# Altium schematic sheet MCU.SchDoc
size A3; Organization: Altium Limited; Address1: L3, 12a Rodborough Rd; Address2: Frenchs Forest; Address3: NSW; Address4: Australia 2086
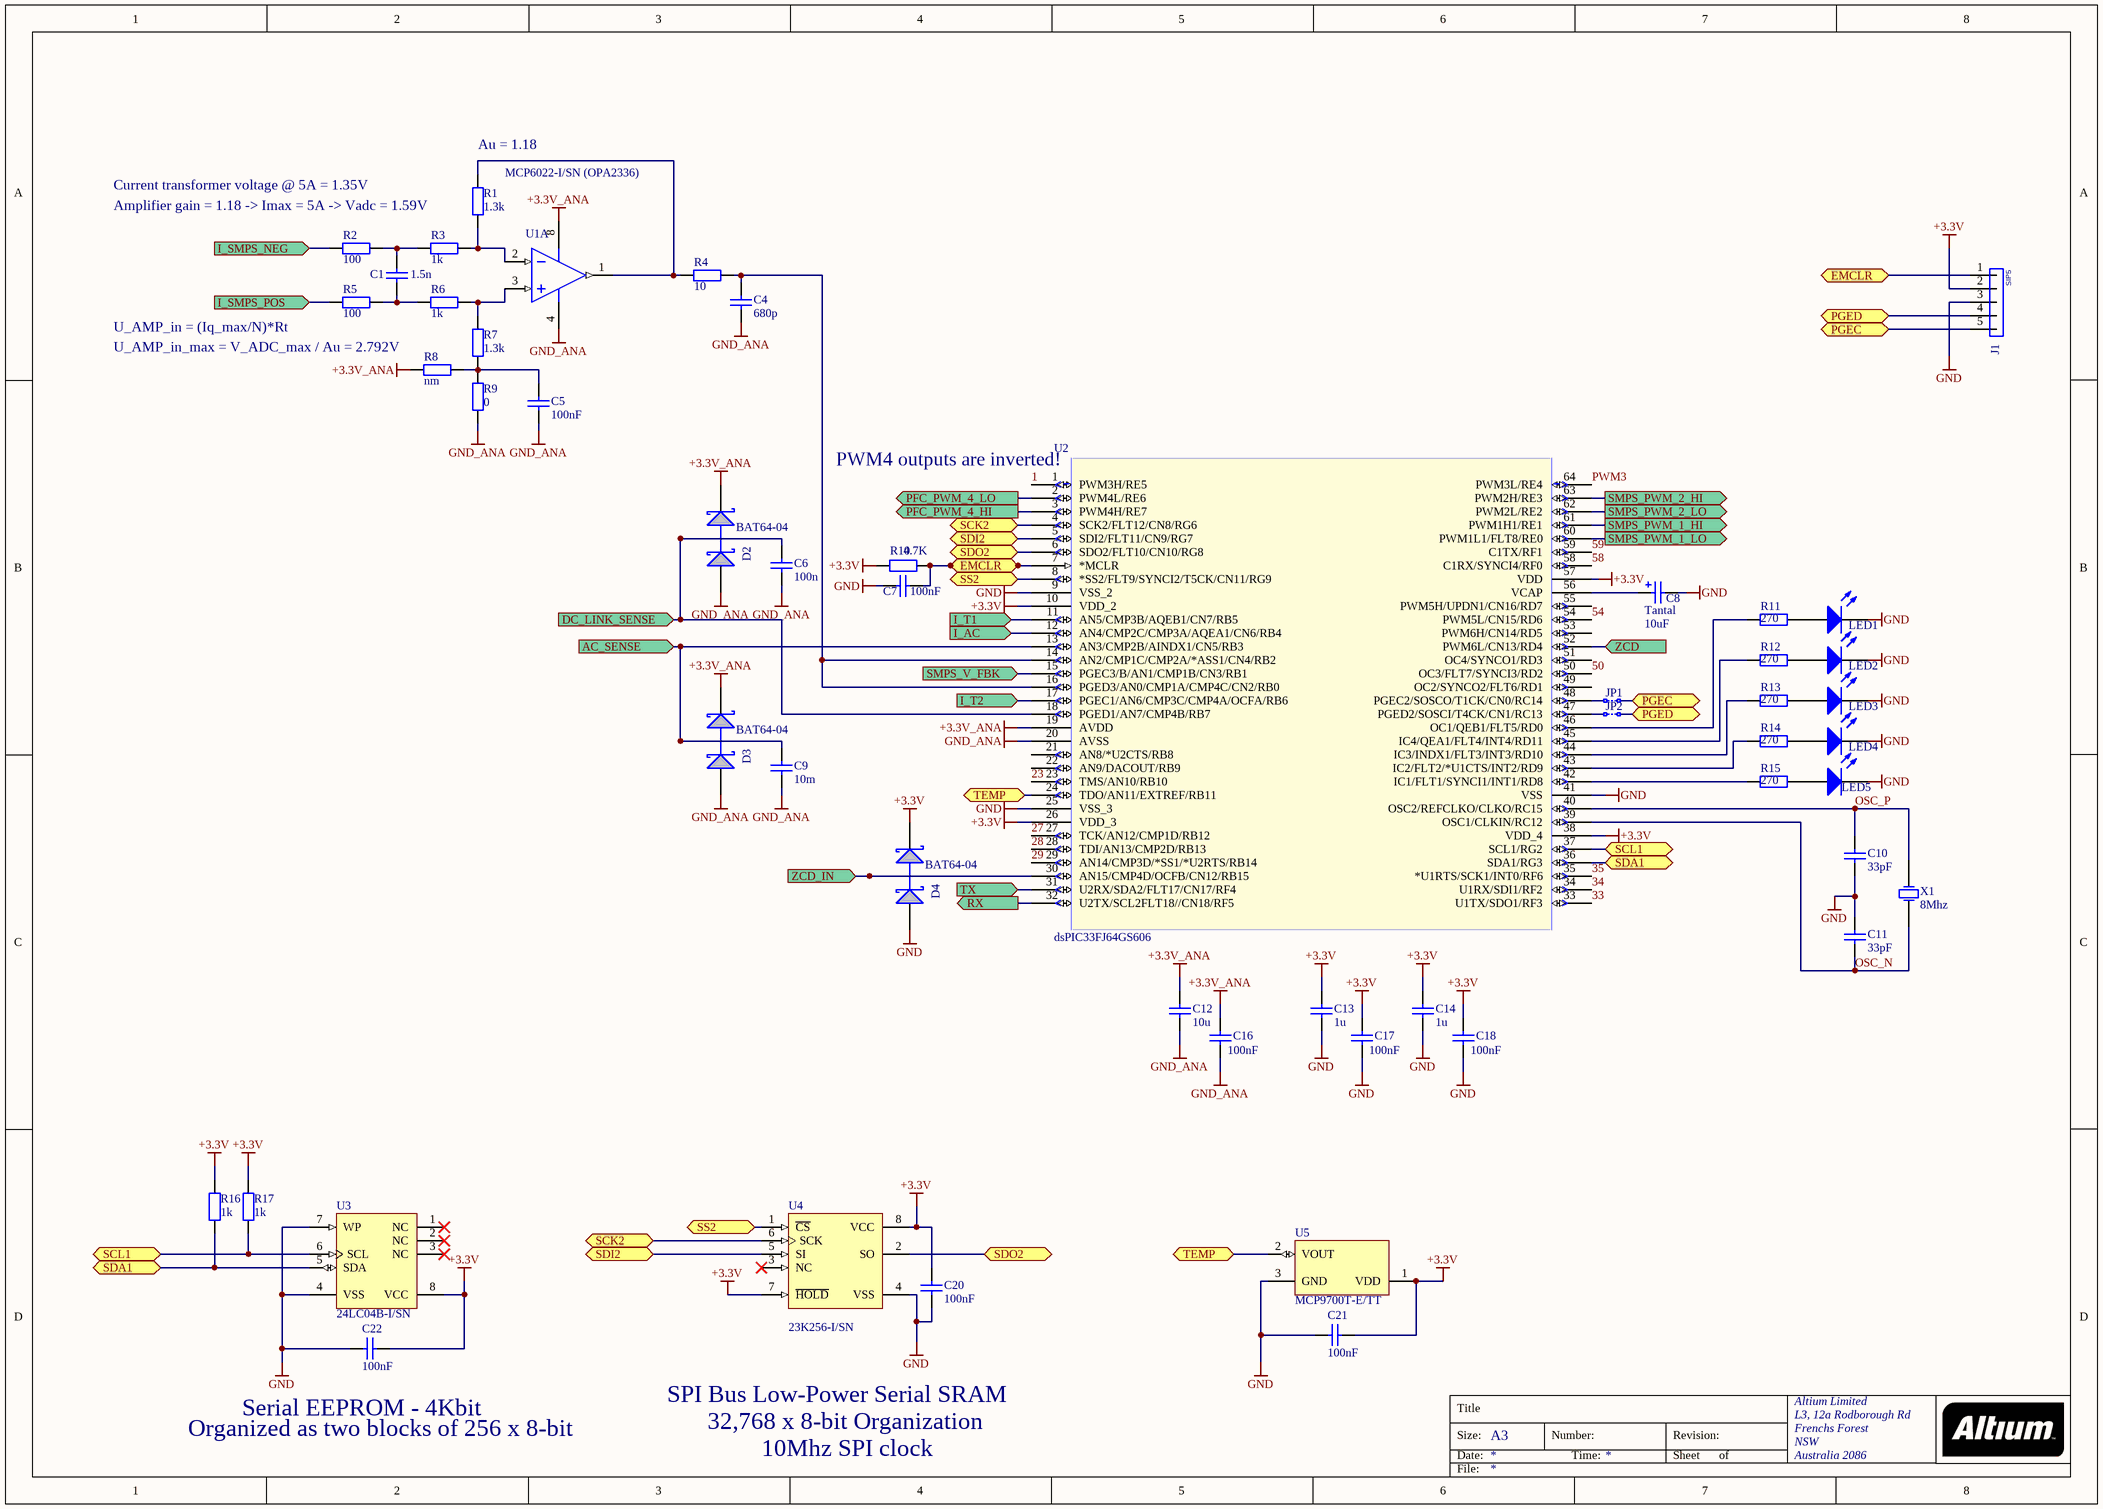
[diagram p0: MCU.SchDoc]

## Parts
C1  value 1.5n  [1206_REFLOW]  (hidden comment: Cap)
C4  value 680p  [1206_REFLOW]  (hidden comment: Cap)
C5  value 100nF  [1206_REFLOW]  (hidden comment: Cap)
C6  value 100n  [1206_REFLOW]  (hidden comment: Cap 1206)
C7  value 100nF  [1206_REFLOW]  (hidden comment: Cap 1206)
C8  Tantal  value 10uF  [CASE D]
C9  value 10m  [1206_REFLOW]  (hidden comment: Cap 1206)
C10  value 33pF  [1206_REFLOW]  (hidden comment: Cap)
C11  value 33pF  [1206_REFLOW]  (hidden comment: Cap)
C12  value 10u  [1206_REFLOW]  (hidden comment: Cap 1206)
C13  value 1u  [1206_REFLOW]  (hidden comment: Cap 1206)
C14  value 1u  [1206_REFLOW]  (hidden comment: Cap 1206)
C16  value 100nF  [1206_REFLOW]  (hidden comment: Cap 1206)
C17  value 100nF  [1206_REFLOW]  (hidden comment: Cap 1206)
C18  value 100nF  [1206_REFLOW]  (hidden comment: Cap 1206)
C20  value 100nF  [1206_REFLOW]  (hidden comment: Cap 1206)
C21  value 100nF  [1206_REFLOW]  (hidden comment: Cap 1206)
C22  value 100nF  [1206_REFLOW]  (hidden comment: Cap 1206)
D2  BAT64-04  [SOT23_HIS_Primary]
D3  BAT64-04  [SOT23_HIS_Primary]
D4  BAT64-04  [SOT23_HIS_Primary]
J1  SIP5  [SIP5 _2]
JP1  SOLDERCONTACT  [SOLDERCONTACT]  (value not drawn)
JP2  SOLDERCONTACT  [SOLDERCONTACT]  (value not drawn)
LED1  LED  [LED_1206]  (value not drawn)
LED2  LED  [LED_1206]  (value not drawn)
LED3  LED  [LED_1206]  (value not drawn)
LED4  LED  [LED_1206]  (value not drawn)
LED5  LED  [LED_1206]  (value not drawn)
R1  value 1.3k  [1206_REFLOW]  (hidden comment: RES)
R2  value 100  [1206_REFLOW]  (hidden comment: RES)
R3  value 1k  [1206_REFLOW]  (hidden comment: RES)
R4  value 10  [1206_REFLOW]  (hidden comment: RES)
R5  value 100  [1206_REFLOW]  (hidden comment: RES)
R6  value 1k  [1206_REFLOW]  (hidden comment: RES)
R7  value 1.3k  [1206_REFLOW]  (hidden comment: RES)
R8  value nm  [1206_REFLOW]  (hidden comment: RES)
R9  value 0  [1206_REFLOW]  (hidden comment: RES)
R10  value 4.7K  [1206_REFLOW]  (hidden comment: RES)
R11  value 270  [1206_REFLOW]  (hidden comment: RES)
R12  value 270  [1206_REFLOW]  (hidden comment: RES)
R13  value 270  [1206_REFLOW]  (hidden comment: RES)
R14  value 270  [1206_REFLOW]  (hidden comment: RES)
R15  value 270  [1206_REFLOW]  (hidden comment: RES)
R16  value 1k  [1206_REFLOW]  (hidden comment: RES)
R17  value 1k  [1206_REFLOW]  (hidden comment: RES)
U1  MCP6022-I/SN (OPA2336)  [SOIC-SN8_N]  (part A of 2)
U2  dsPIC33FJ64GS606  [TQFP-PT64_N]
U3  24LC04B-I/SN  [SOIC-SN8_N]
U4  23K256-I/SN  [SOIC-SN8_N]
U5  MCP9700T-E/TT  [SOT-23-TT3_N]
X1  value 8Mhz  [XTAL]  (hidden comment: XTAL)

## Ports
AC_SENSE (in), DC_LINK_SENSE (in), EMCLR, I_AC (in), I_SMPS_NEG (in), I_SMPS_POS (in), I_T1 (in), I_T2 (in), PFC_PWM_4_HI (out), PFC_PWM_4_LO (out), PGEC, PGED, RX (out), SCK2 (bidir), SCL1 (bidir), SDA1 (bidir), SDI2 (bidir), SDO2 (bidir), SMPS_PWM_1_HI (out), SMPS_PWM_1_LO (out), SMPS_PWM_2_HI (out), SMPS_PWM_2_LO (out), SMPS_V_FBK (in), SS2, TEMP (bidir), TX (in), ZCD (in), ZCD_IN (in)

## Nets
+3.3V: C13.2 C14.2 C17.2 C18.2 C20.1 C21.1 C22.1 D4.2(K) J1.2 R10.1 R16.1 R17.1 U2.10(VDD_2) U2.26(VDD_3) U2.38(VDD_4) U2.57(VDD) U3.8(VCC) U4.7(~{HOLD}) U4.8(VCC) U5.1(VDD)
+3.3V_ANA: C12.2 C16.2 D2.2(K) D3.2(K) R8.1 U1.8(VDD) U2.19(AVDD)
GND: C7.1 C8.2 C10.1 C11.2 C13.1 C14.1 C17.1 C18.1 C20.2 C21.2 C22.2 D4.1(A) J1.3 LED1.K LED2.K LED3.K LED4.K LED5.K U2.9(VSS_2) U2.25(VSS_3) U2.41(VSS) U3.4(VSS) U3.7(WP) U4.4(VSS) U5.3(GND)
GND_ANA: C4.1 C5.1 C6.1 C9.1 C12.1 C16.1 D2.1(A) D3.1(A) R9.1 U1.4(VSS) U2.20(AVSS)
1: U2.1(PWM3H/RE5)
23: U2.23(TMS/AN10/RB10)
27: U2.27(TCK/AN12/CMP1D/RB12)
28: U2.28(TDI/AN13/CMP2D/RB13)
29: U2.29(AN14/CMP3D/*SS1/*U2RTS/RB14)
33: U2.33(U1TX/SDO1/RF3)
34: U2.34(U1RX/SDI1/RF2)
35: U2.35(*U1RTS/SCK1/INT0/RF6)
50: U2.50(OC3/FLT7/SYNCI3/RD2)
54: U2.54(PWM5L/CN15/RD6)
58: U2.58(C1RX/SYNCI4/RF0)
59: U2.59(C1TX/RF1)
AC_SENSE: C9.2 D3.3(C) U2.13(AN3/CMP2B/AINDX1/CN5/RB3) ; port AC_SENSE
DC_LINK_SENSE: C6.2 D2.3(C) U2.18(PGED1/AN7/CMP4B/RB7) ; port DC_LINK_SENSE
EMCLR: C7.2 J1.1 R10.2 U2.7(*MCLR) ; port EMCLR
I_AC: U2.12(AN4/CMP2C/CMP3A/AQEA1/CN6/RB4) ; port I_AC
I_SMPS_NEG: R2.1 ; port I_SMPS_NEG
I_SMPS_POS: R5.1 ; port I_SMPS_POS
I_T1: U2.11(AN5/CMP3B/AQEB1/CN7/RB5) ; port I_T1
I_T2: U2.17(PGEC1/AN6/CMP3C/CMP4A/OCFA/RB6) ; port I_T2
OSC_N: C11.1 U2.39(OSC1/CLKIN/RC12) X1.1(OSC1)
OSC_P: C10.2 U2.40(OSC2/REFCLKO/CLKO/RC15) X1.2(OSC2)
PFC_PWM_4_HI: U2.3(PWM4H/RE7) ; port PFC_PWM_4_HI
PFC_PWM_4_LO: U2.2(PWM4L/RE6) ; port PFC_PWM_4_LO
PGEC: J1.5 JP1.2 ; port PGEC
PGED: J1.4 JP2.1 ; port PGED
PWM3: U2.64(PWM3L/RE4)
RX: U2.32(U2TX/SCL2FLT18//CN18/RF5) ; port RX
SCK2: U2.4(SCK2/FLT12/CN8/RG6) U4.6(SCK) ; port SCK2
SCL1: R17.2 U2.37(SCL1/RG2) U3.6(SCL) ; port SCL1
SDA1: R16.2 U2.36(SDA1/RG3) U3.5(SDA) ; port SDA1
SDI2: U2.5(SDI2/FLT11/CN9/RG7) U4.5(SI) ; port SDI2
SDO2: U2.6(SDO2/FLT10/CN10/RG8) U4.2(SO) ; port SDO2
SMPS_PWM_1_HI: U2.61(PWM1H1/RE1) ; port SMPS_PWM_1_HI
SMPS_PWM_1_LO: U2.60(PWM1L1/FLT8/RE0) ; port SMPS_PWM_1_LO
SMPS_PWM_2_HI: U2.63(PWM2H/RE3) ; port SMPS_PWM_2_HI
SMPS_PWM_2_LO: U2.62(PWM2L/RE2) ; port SMPS_PWM_2_LO
SMPS_V_FBK: U2.15(PGEC3/B/AN1/CMP1B/CN3/RB1) ; port SMPS_V_FBK
SS2: U2.8(*SS2/FLT9/SYNCI2/T5CK/CN11/RG9) U4.1(~{CS}) ; port SS2
TEMP: U2.24(TDO/AN11/EXTREF/RB11) U5.2(VOUT) ; port TEMP
TX: U2.31(U2RX/SDA2/FLT17/CN17/RF4) ; port TX
ZCD: U2.52(PWM6L/CN13/RD4) ; port ZCD
ZCD_IN: D4.3(C) U2.30(AN15/CMP4D/OCFB/CN12/RB15) ; port ZCD_IN
NetC1_1: C1.1 R5.2 R6.1
NetC1_2: C1.2 R2.2 R3.1
NetC4_2: C4.2 R4.1 U2.14(AN2/CMP1C/CMP2A/*ASS1/CN4/RB2) U2.16(PGED3/AN0/CMP1A/CMP4C/CN2/RB0)
NetC5_2: C5.2 R7.1 R8.2 R9.2
NetC8_1: C8.1 U2.56(VCAP)
NetJP1_1: JP1.1 U2.48(PGEC2/SOSCO/T1CK/CN0/RC14)
NetJP2_2: JP2.2 U2.47(PGED2/SOSCI/T4CK/CN1/RC13)
NetLED1_A: LED1.A R11.2
NetLED2_A: LED2.A R12.2
NetLED3_A: LED3.A R13.2
NetLED4_A: LED4.A R14.2
NetLED5_A: LED5.A R15.2
NetR1_1: R1.1 R3.2 U1.2(VINA-)
NetR1_2: R1.2 R4.2 U1.1(VOUTA)
NetR6_2: R6.2 R7.2 U1.3(VINA+)
NetR11_1: R11.1 U2.46(OC1/QEB1/FLT5/RD0)
NetR12_1: R12.1 U2.45(IC4/QEA1/FLT4/INT4/RD11)
NetR13_1: R13.1 U2.44(IC3/INDX1/FLT3/INT3/RD10)
NetR14_1: R14.1 U2.43(IC2/FLT2/*U1CTS/INT2/RD9)
NetR15_1: R15.1 U2.42(IC1/FLT1/SYNCI1/INT1/RD8)

Not connected (* = marked no-connect by the designer): U2 21(AN8/*U2CTS/RB8) 22(AN9/DACOUT/RB9) 49(OC2/SYNCO2/FLT6/RD1) 51(OC4/SYNCO1/RD3) 53(PWM6H/CN14/RD5) 55(PWM5H/UPDN1/CN16/RD7); U3 1(NC)* 2(NC)* 3(NC)*; U4 3(NC)*

## Notes on the sheet
- (near R1) Au = 1.18
- Current transformer voltage @ 5A = 1.35V
- (near R1) Amplifier gain = 1.18 -> Imax = 5A -> Vadc = 1.59V
- U_AMP_in = (Iq_max/N)*Rt
- U_AMP_in_max = V_ADC_max / Au = 2.792V
- (near U2) PWM4 outputs are inverted!
- Organized as two blocks of 256 x 8-bit
- (near C22) Serial EEPROM - 4Kbit
- SPI Bus Low-Power Serial SRAM
- 32,768 x 8-bit Organization
- 10Mhz SPI clock
- Title
- Size:
- Date:
- A3
- Number:
- Time:
- Revision:
- Sheet
- of
- File:

## Library data of the parts
C8 = CAP CASE D
D2-D4 = BAT64-04: Silicon Schottky Diodes; Manufacturer: INF; ComponentLink1DescBC: Manufacturer Link; Group: Discrete; Subgroup: Diode; Published: 21-Mar-2003; DatasheetDocument: Oct-1999; PackageDocument: Sep-2001; PackageReference: SOT-23; Publisher: Altium Limited; ComponentLink1URL: http://www.infineon.com/; Value: BAT64-04
JP1 JP2 = SOLDERCONTACT: Value: JP
LED1-LED5 = LED: Value: TBD
R1 R7-R17 = RES 1
  R1 R7-R9 R11-R15: Tolerance: *
R2-R6 = RES 1: Tolerance: 1%
U1 = MCP6022-I/SN: Rail-to-Rail Input/Output, 10 MHz Operational Amplifier, 8-Pin SOIC, Industrial Temperature; Published: 29-Jan-2009; DatasheetVersion: revC, Mar-2006; PackageVersion: revAW, Oct-2008; PackageReference: SOIC-SN8; Publisher: Altium Limited; PackageDescription: 8-Lead Plastic Small Outline (SN) - Narrow, 3.90mm Body [SOIC]; Code_JEDEC: MS-012; Code_IPC: SOIC127P600-8; ComponentLink1Description: Manufacturer Link; ComponentLink1URL: http://www.microchip.com; ComponentLink2Description: Datasheet; ComponentLink2URL: http://ww1.microchip.com/downloads/en/DeviceDoc/21685c.pdf; ComponentLink3Description: Packaging Specification; ComponentLink3URL: http://ww1.microchip.com/downloads/en/PackagingSpec/00049AW.pdf
U3 = 24LC04B-I/SN: 4Kbit, 400kHz, 2.5V, I2C Serial EEPROM, 8-Pin SOIC 150mil, Industrial Temperature; Published: 29-Jan-2009; DatasheetVersion: revG, Mar-2007; PackageVersion: revAW, Oct-2008; PackageReference: SOIC-SN8; Publisher: Altium Limited; PackageDescription: 8-Lead Plastic Small Outline (SN) - Narrow, 3.90mm Body [SOIC]; Code_JEDEC: MS-012; Code_IPC: SOIC127P600-8; ComponentLink1Description: Manufacturer Link; ComponentLink1URL: http://www.microchip.com; ComponentLink2Description: Datasheet; ComponentLink2URL: http://ww1.microchip.com/downloads/en/DeviceDoc/21708G.pdf; ComponentLink3Description: Packaging Specification; ComponentLink3URL: http://ww1.microchip.com/downloads/en/PackagingSpec/00049AW.pdf
U4 = 25LC640AT-I/SN: IC, SRAM, SERIAL, 256K, 2.7V, SOIC8; Value: 23K256-I/SN; Farnell Order Code: 1695547
U5 = MCP9700T-E/TT: Low-Power Linear Active Thermistor IC, 3-Pin SOT-23, Extended Temperature, Tape and Reel; Published: 29-Jan-2009; DatasheetVersion: revD, Oct-2007; PackageVersion: revAW, Oct-2008; PackageReference: SOT-23-TT3; Publisher: Altium Limited; Code_IPC: SOT23-3; ComponentLink1Description: Manufacturer Link; ComponentLink1URL: http://www.microchip.com; ComponentLink2Description: Datasheet; ComponentLink2URL: http://ww1.microchip.com/downloads/en/DeviceDoc/21942d.pdf; ComponentLink3Description: Packaging Specification; ComponentLink3URL: http://ww1.microchip.com/downloads/en/PackagingSpec/00049AW.pdf
C1 C4 C5 C10 C11 = Cap
  C1 C4 C5: Voltage: *; Manufacturer: *; Supplier Order Code: *; Manufacturer Order Code: *; Supplier: *
J1 = SIP5: Value: *